# EAGLE design baum (EAGLE 7.1.0)
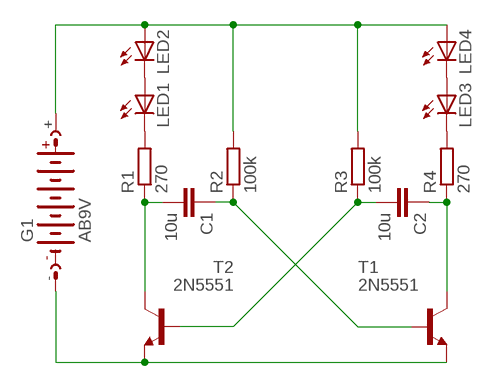
[diagram p0: schematic, sheet 1]

## Parts
C1  10u  C-EU050-025X075  [C050-025X075]
C2  10u  C-EU050-025X075  [C050-025X075]
G1  AB9V  [AB9V]
LED1  LED3MM  [LED3MM]
LED2  LED3MM  [LED3MM]
LED3  LED3MM  [LED3MM]
LED4  LED3MM  [LED3MM]
R1  270  R-EU_0207/10  [0207/10]
R2  100k  R-EU_0207/10  [0207/10]
R3  100k  R-EU_0207/10  [0207/10]
R4  270  R-EU_0207/10  [0207/10]
T1  2N5551  2N5551-NPN-TO92-CBE  [TO92-CBE]
T2  2N5551  2N5551-NPN-TO92-CBE  [TO92-CBE]

## Nets
GND: G1.- T1.E T2.E
N$1: C1.2 R1.1 T2.C
N$2: C2.1 R4.1 T1.C
N$3: C1.1 R2.1 T1.B
N$4: C2.2 R3.1 T2.B
N$5: LED1.K(C) R1.2
N$6: LED1.A LED2.K(C)
N$7: LED3.K(C) R4.2
N$8: LED3.A LED4.K(C)
N$9: G1.+ LED2.A LED4.A R2.2 R3.2

## Library data of the parts
C1 C2 = rcl:C-EU: CAPACITOR, European symbol
G1 = battery:AB9V: 9-V BATTERY CLIP
LED1-LED4 = led:LED: LED OSRAM: - CHIPLED LG R971, LG N971, LY N971, LG Q971, LY Q971, LO R971, LY R971 LH N974, LH R974 LS Q976, LO Q976, LY Q976 LO Q996 - Hyper CHIPLED LW Q18S LB Q993, LB Q99A, LB R99A - SideLED LS A670, LO A670, LY A670, LG A670, LP A670 LB A673, LV A673, LT A673, LW A673 LH A674 LY A675 LS A676, LA A676, LO A676, LY A676, LW A676 LS A679, LY A679, LG A679 - Hyper Micro SIDELED® LS Y876, LA Y876, LO Y876, LY Y876 LT Y87S - SmartLED LW L88C, LW L88S LB L89C, LB L89S, LG L890 LS L89K, LO L89K, LY L89K LS L896, LA L896, LO L896, LY L896 - TOPLED LS T670, LO T670, LY T670, LG T670, LP T670 LSG T670, LSP T670, LSY T670, LOP T670, LYG T670 LG T671, LOG T671, LSG T671 LB T673, LV T673, LT T673, LW T673 LH T674 LS T676, LA T676, LO T676, LY T676, LB T676, LH T676, LSB T676, LW T676 LB T67C, LV T67C, LT T67C, LS T67K, LO T67K, LY T67K, LW E67C LS E67B, LA E67B, LO E67B, LY E67B, LB E67C, LV E67C, LT E67C LW T67C LS T679, LY T679, LG T679 LS T770, LO T770, LY T770, LG T770, LP T770 LB T773, LV T773, LT T773, LW T773 LH T774 LS E675, LA E675, LY E675, LS T675 LS T776, LA T776, LO T776, LY T776, LB T776 LHGB T686 LT T68C, LB T68C - Hyper Mini TOPLED® LB M676 - Mini TOPLED Santana® LG M470 LS M47K, LO M47K, LY M47K Source: http://www.osram.convergy.de LUXEON: - LUMILED® LXK2-PW12-R00, LXK2-PW12-S00, LXK2-PW14-U00, LXK2-PW14-V00 LXK2-PM12-R00, LXK2-PM12-S00, LXK2-PM14-U00 LXK2-PE12-Q00, LXK2-PE12-R00, LXK2-PE12-S00, LXK2-PE14-T00, LXK2-PE14-U00 LXK2-PB12-K00, LXK2-PB12-L00, LXK2-PB12-M00, LXK2-PB14-N00, LXK2-PB14-P00, LXK2-PB14-Q00 LXK2-PR12-L00, LXK2-PR12-M00, LXK2-PR14-Q00, LXK2-PR14-R00 LXK2-PD12-Q00, LXK2-PD12-R00, LXK2-PD12-S00 LXK2-PH12-R00, LXK2-PH12-S00 LXK2-PL12-P00, LXK2-PL12-Q00, LXK2-PL12-R00 Source: www.luxeon.com KINGBRIGHT: KA-3528ASYC Source: www.kingbright.com
R1-R4 = rcl:R-EU_: RESISTOR, European symbol
T1 T2 = transistor:*-NPN-: NPN Transistror BF959 corrected 2008.03.06

## Board
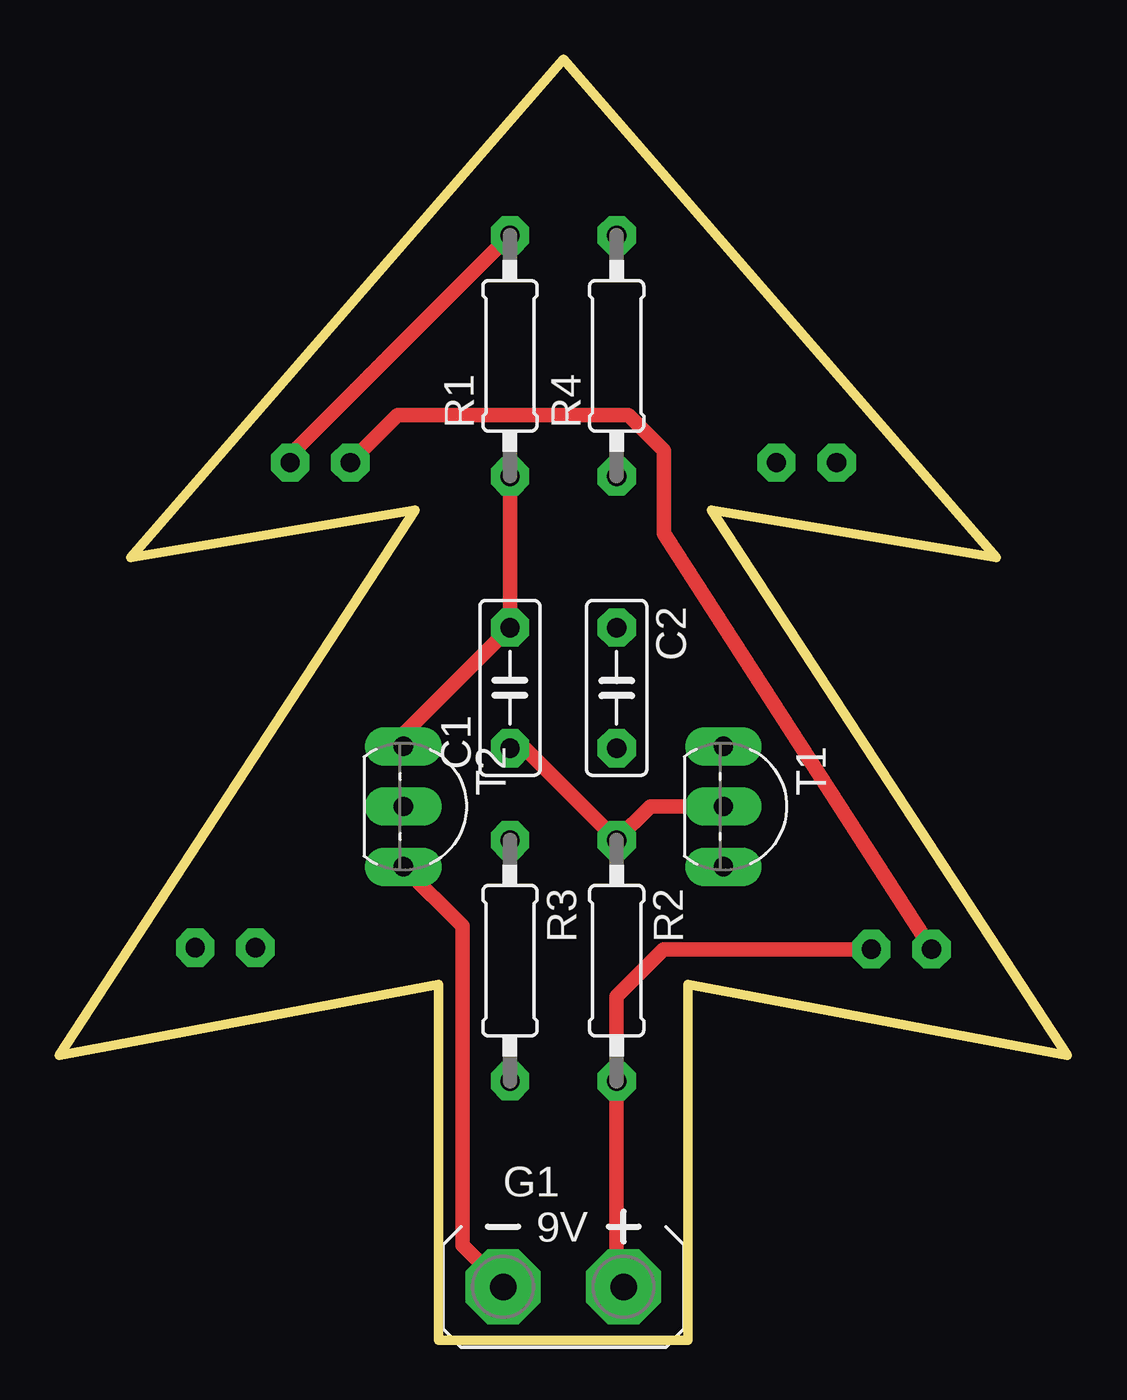
[diagram p1: board, top side]
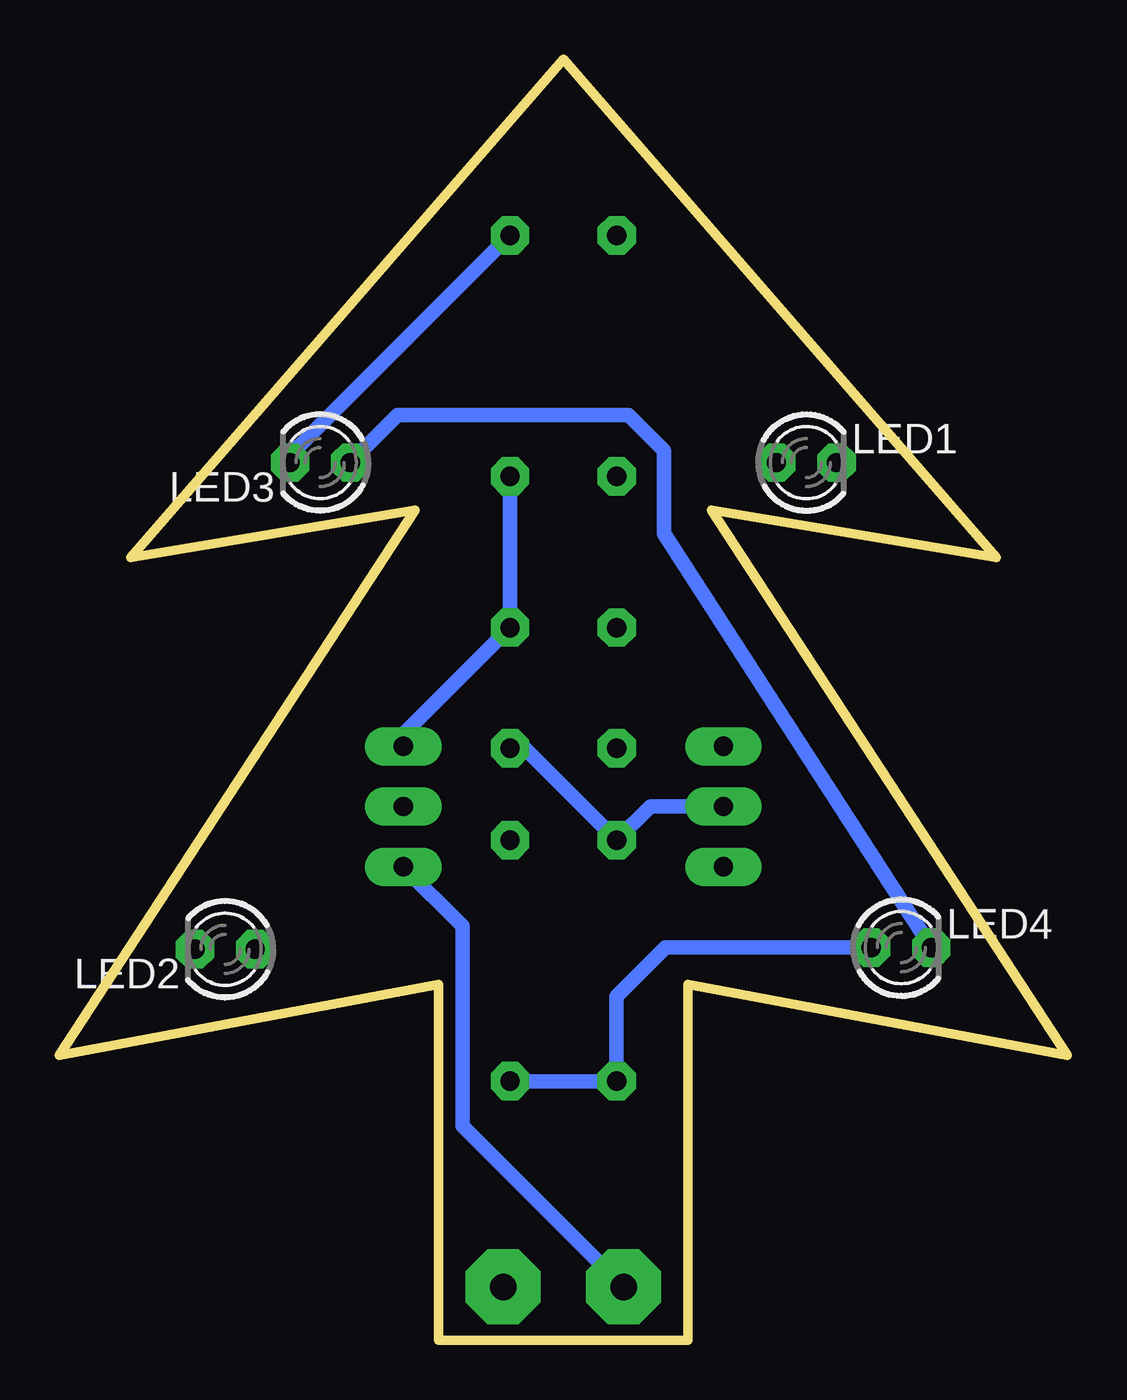
[diagram p2: board, bottom side, seen from below]

Size 42.5 x 54 mm. Coordinates in mm from the lower left corner, seen from the top.
Outline: 16,0 26.5,0 26.5,15 42.5,12 27.5,35 39.5,33 21.25,54 3,33 15,35 0,12 16,15 16,0
Copper layers (1*16): Top 0.035mm / dielectric 1.5mm / Bottom 0.035mm
Design rules "LeitOn - Standard-Eagle-DRU - 1- and  2-Layer PTH - english - Rev 2.0 *": minimum track width 24mil, minimum drill 0.3mm, track to track 0.15mm, track to pad 0.15mm, pad to pad 0.15mm, via to via 0.15mm, smd to smd 0.15mm, copper to edge 0.3mm, drill to drill 0.3mm, minimum pad ring 0.4mm, minimum via ring 0.4mm, stop-mask expansion 0.075mm, vias tented up to drill 0mil, thermal gap 0.2mm

### Footprints (pad centres in the part's own frame; a part is rotated, then mirrored left to right if it is on the bottom)
C050-025X075 = drill 0.813 octagon: 1 -2.54,0; 2 2.54,0
AB9V = drill 1.118 pad 3.15 octagon: + 0,2.54; - 0,-2.54
LED3MM = drill 0.813 octagon: A -1.27,0; K 1.27,0
0207/10 = drill 0.813 octagon: 1 -5.08,0; 2 5.08,0
TO92-CBE = drill 0.813 long: B 0,0; C -2.54,0; E 2.54,0

### Placement (x,y rotation side)
C1  19,27.5 90 top
C2  23.5,27.5 270 top
G1  21.25,2.25 270 top
LED1  11,37 0 bottom
LED2  35.51,16.48 180 bottom
LED3  31.5,37 180 bottom
LED4  7,16.55 0 bottom
R1  19,41.5 90 top
R2  23.5,16 270 top
R3  19,16 270 top
R4  23.5,41.5 90 top
T1  28,22.5 270 top
T2  14.5,22.5 270 top

### Tracks (layer width: path | path; a pad name or v marks a point on that pad's centre or on a via)
GND
  Top 0.61: G1.- 18.71,2.29 17,4 17,17.46 T2.E
  Bottom 0.61: T1.E 25.5,17.46 25.5,9.04 G1.-
N$1
  Top 0.61: R1.1 C1.2 14.5,25.54 T2.C
N$2
  Bottom 0.61: R4.1 C2.1 28,25.54 T1.C
N$3
  Top 0.61: C1.1 19.62,24.96 R2.1 24.92,22.5 T1.B
N$4
  Bottom 0.61: C2.2 22.88,24.96 R3.1 17.58,22.5 T2.B
N$5
  Top 0.61: LED1.K 9.73,37.31 R1.2
N$6
  Top 0.61: LED2.K 25.5,34 25.5,37.5 24,39 14.27,39 LED1.A
N$7
  Bottom 0.61: LED3.K 32.77,37.31 R4.2
N$8
  Bottom 0.61: LED4.K 17,34 17,37.5 18.5,39 28.23,39 LED3.A
N$9
  Top 0.61: LED2.A 25.48,16.48 23.5,14.5 R2.2 23.5,2.54 G1.+
  Bottom 0.61: LED4.A 16.95,16.55 19,14.5 R3.2 R2.2